# Altium schematic sheet supply.SchDoc
size A3; DocumentNumber: 5; SheetNumber: 5; SheetTotal: 6; PageSetup: Record=PageOptions|CenterHorizontal=True|CenterVertical=True|PrintScale=0.97|XCorrection=1.00|YCorrection=1.00|PrintKind=1|BorderSize=5000000|LeftOffset=0|BottomOffset=0|Orientation=2|PaperLength=2970|PaperWidth=2100|Scale=100|PaperSource=7|PrintQuality=600|MediaType=1|DitherType=10|PaperKind=A4|PrintScaleMode=1
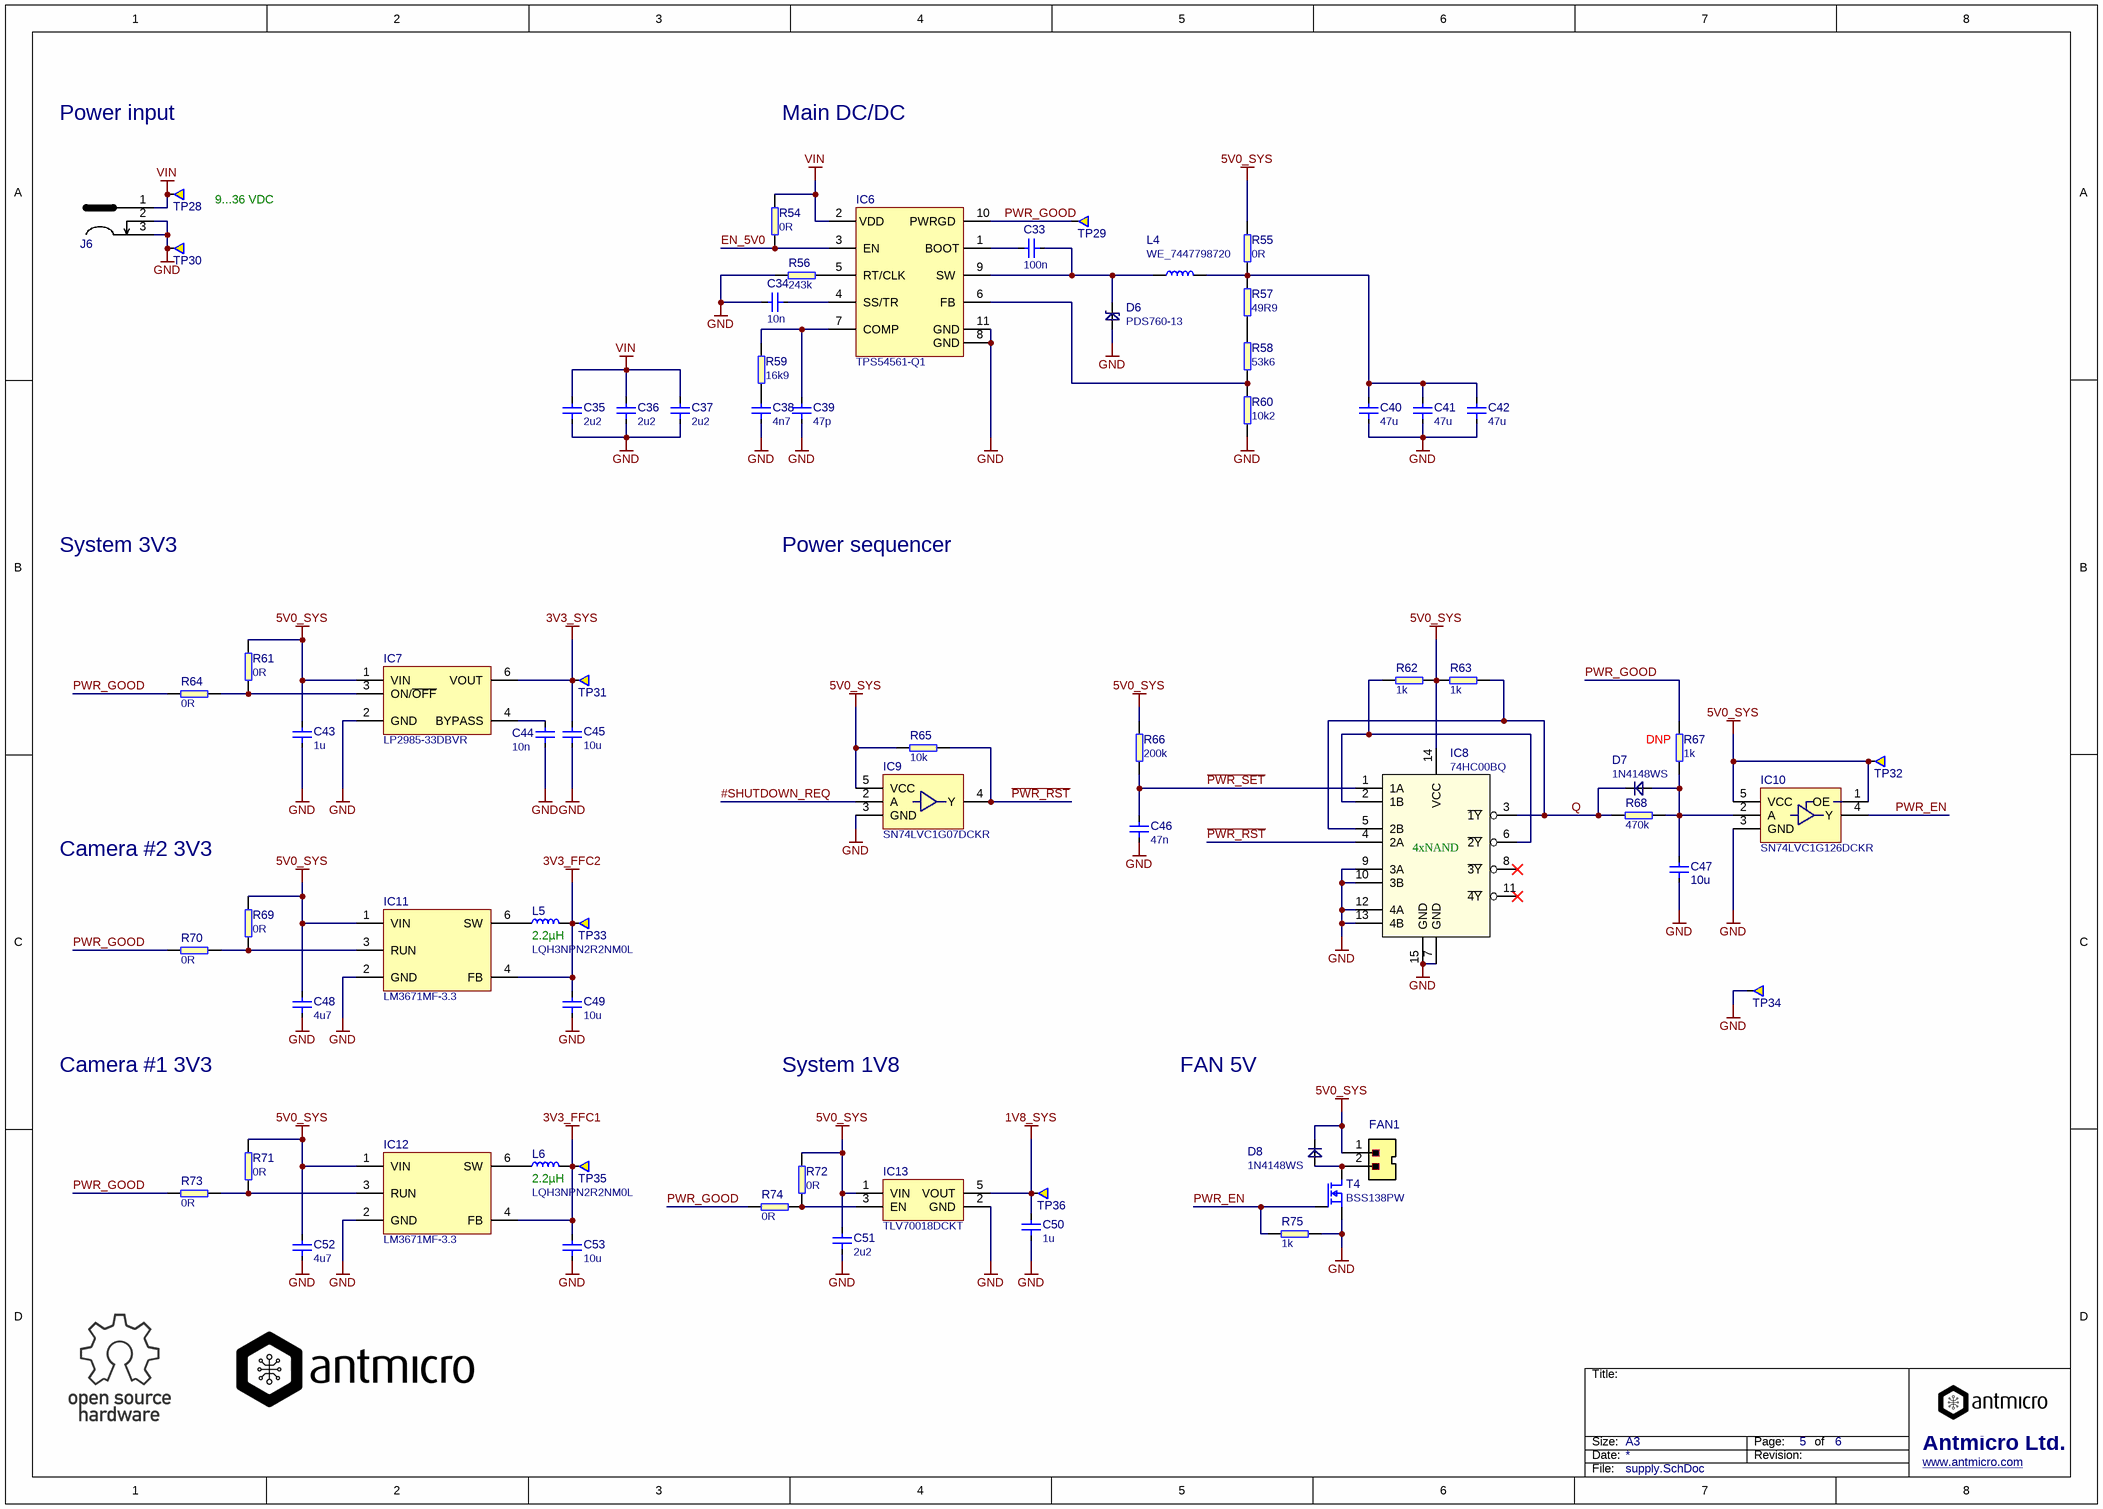
[diagram p0: supply.SchDoc]

## Parts
C33  100n  [0603]
C34  10n  [0402]
C35  2u2  [1206]
C36  2u2  [1206]
C37  2u2  [1206]
C38  4n7  [0402]
C39  47p  [0402]
C40  47u  [0805]
C41  47u  [0805]
C42  47u  [0805]
C43  1u  [0603]
C44  10n  [0402]
C45  10u  [0402]
C46  47n  [0402]
C47  10u  [0402]
C48  4u7  [0603]
C49  10u  [0603]
C50  1u  [0402]
C51  2u2  [0402]
C52  4u7  [0603]
C53  10u  [0603]
D6  PDS760-13  [PowerDI]
D7  1N4148WS  [SOD-323]
D8  1N4148WS  [SOD-323]
FAN1  MX-22-23-2021  [molex_2223-2021]  (value not drawn)
IC6  TPS54561-Q1  [WSON-10_4x4]
IC7  LP2985-33DBVR  [SOT23-5N]
IC8  74HC00BQ  [DHVQFN14]
IC9  SN74LVC1G07DCKR  [R-PDSO-G5]
IC10  SN74LVC1G126DCKR  [R-PDSO-G5]
IC11  LM3671MF-3.3  [SOT23-5N]
IC12  LM3671MF-3.3  [SOT23-5N]
IC13  TLV70018DCKT  [SC70-5]
J6  MJ-179PH  [DC_SOCKET]  (value not drawn)
L4  WE_7447798720  [WE_7447798720]
L5  LQH3NPN2R2NM0L  [LQH3NPN2R2NM]
L6  LQH3NPN2R2NM0L  [LQH3NPN2R2NM]
R54  0R  [0402]
R55  0R  [1206]
R56  243k  [0402]
R57  49R9  [0402]
R58  53k6  [0402]
R59  16k9  [0402]
R60  10k2  [0402]
R61  0R  [0402]
R62  1k  [0402]
R63  1k  [0402]
R64  0R  [0402]
R65  10k  [0402]
R66  200k  [0402]
R67  1k  [0402]
R68  470k  [0603]
R69  0R  [0402]
R70  0R  [0402]
R71  0R  [0402]
R72  0R  [0402]
R73  0R  [0402]
R74  0R  [0402]
R75  1k  [0402]
T4  BSS138PW  [SC70-3]
TP28  Testpad  [TP-R-1.5]  (value not drawn)  (no BOM)
TP29  Testpad  [TP-R-1.5]  (value not drawn)  (no BOM)
TP30  Testpad  [TP-R-1.5]  (value not drawn)  (no BOM)
TP31  Testpad  [TP-R-1.5]  (value not drawn)  (no BOM)
TP32  Testpad  [TP-R-1.5]  (value not drawn)  (no BOM)
TP33  Testpad  [TP-R-1.5]  (value not drawn)  (no BOM)
TP34  Testpad  [TP-R-1.5]  (value not drawn)  (no BOM)
TP35  Testpad  [TP-R-1.5]  (value not drawn)  (no BOM)
TP36  Testpad  [TP-R-1.5]  (value not drawn)  (no BOM)

## Nets
1V8_SYS: C50.2 IC13.5(VOUT) TP36.1
3V3_FFC1: C53.2 IC12.4(FB) L6.2 TP35.1
3V3_FFC2: C49.2 IC11.4(FB) L5.2 TP33.1
3V3_SYS: C45.2 IC7.6(VOUT) TP31.1
5V0_SYS: C43.2 C48.2 C51.2 C52.2 D8.C FAN1.1 IC7.1(VIN) IC8.14(VCC) IC9.5(VCC) IC10.1(OE) IC10.5(VCC) IC11.1(VIN) IC12.1(VIN) IC13.1(VIN) R55.2 R61.2 R62.1 R63.2 R65.1 R66.2 R69.2 R71.2 R72.1 TP32.1
GND: C34.2 C35.1 C36.1 C37.1 C38.1 C39.1 C40.1 C41.1 C42.1 C43.1 C44.1 C45.1 C46.1 C47.1 C48.1 C49.1 C50.1 C51.1 C52.1 C53.1 D6.A IC6.8(GND) IC6.11(GND) IC7.2(GND) IC8.7(GND) IC8.9(3A) IC8.10(3B) IC8.12(4A) IC8.13(4B) IC8.15(GND) IC9.3(GND) IC10.3(GND) IC11.2(GND) IC12.2(GND) IC13.2(GND) J6.2 J6.3 R56.2 R60.1 R75.1 T4.2(S) TP30.1 TP34.1
VIN: C35.2 C36.2 C37.2 IC6.2(VDD) J6.1 R54.2 TP28.1
#SHUTDOWN_REQ: IC9.2(A)
~{PWR_RST}: IC8.4(2A) IC9.4(Y) R65.2
~{PWR_SET}: C46.2 IC8.1(1A) R66.1
EN_5V0: IC6.3(EN) R54.1
PWR_EN: IC10.4(Y) R75.2 T4.1(G)
PWR_GOOD: IC6.10(PWRGD) R64.2 R67.1 R70.2 R73.2 R74.2 TP29.1
Q: D7.C IC8.3(~{1Y}) IC8.5(2B) R63.1 R68.1
NetC33_1: C33.1 D6.C IC6.9(SW) L4.1
NetC33_2: C33.2 IC6.1(BOOT)
NetC34_1: C34.1 IC6.4(SS/TR)
NetC38_2: C38.2 R59.1
NetC39_2: C39.2 IC6.7(COMP) R59.2
NetC40_2: C40.2 C41.2 C42.2 L4.2 R55.1 R57.2
NetC44_2: C44.2 IC7.4(BYPASS)
NetC47_2: C47.2 D7.A IC10.2(A) R67.2 R68.2
NetD8_A: D8.A FAN1.2 T4.3(D)
NetIC6_5: IC6.5(RT/CLK) R56.1
NetIC6_6: IC6.6(FB) R58.1 R60.2
NetIC7_3: IC7.3(ON/~{OFF}) R61.1 R64.1
NetIC8_2: IC8.2(1B) IC8.6(~{2Y}) R62.2
NetIC11_3: IC11.3(RUN) R69.1 R70.1
NetIC11_6: IC11.6(SW) L5.1
NetIC12_3: IC12.3(RUN) R71.1 R73.1
NetIC12_6: IC12.6(SW) L6.1
NetIC13_3: IC13.3(EN) R72.2 R74.1
NetR57_1: R57.1 R58.2

Not connected (* = marked no-connect by the designer): IC8 8(~{3Y})* 11(~{4Y})*

## Notes on the sheet
- Power input
- Main DC/DC
- 9...36 VDC
- System 3V3
- Power sequencer
- (near R67) DNP
- Camera #2 3V3
- (near L5) 2.2µH
- Camera #1 3V3
- System 1V8
- FAN 5V
- (near L6) 2.2µH
- Title:
- Size:
- Date:
- A3
- Revision:
- Page:
- of
- Antmicro Ltd.
- File:
- www.antmicro.com
- (in symbol 74HC00BQ) 4xNAND

## Library data of the parts
C33 = C_100n_0603: MLCC SMT Capacitor 100nF 0603; Manufacturer: AVX; PartSymbol: 0603YC104KAZ2A; PartNumber: C_100n_0603; Value: 100n
C34 C44 = C_10n_0402: MLCC SMT Capacitor 10 nF 0402; Manufacturer: AVX; PartSymbol: 04025G103ZAT2A; PartNumber: C_10n_0402; Value: 10n
C35-C37 = C_2u2_1206: MLCC SMT Capacitor 2.2uF 1206; Manufacturer: KEMET; PartSymbol: C1206C225J5RACTU; PartNumber: C_2u2_1206; Value: 2u2
C38 = C_4n7_0402: MLCC SMT Capacitor 4.7 nF 0402; Manufacturer: TDK; PartSymbol: CGA2B3X7S2A472K050BB; PartNumber: C_4n7_0402; Value: 4n7
C39 = C_47p_0402: MLCC SMT Capacitor 47pF 0402; Manufacturer: KEMET; PartSymbol: C0402C470J5GACTU; PartNumber: C_47p_0402; Value: 47p
C40-C42 = C_47u_0805: MLCC SMT Capacitor 47uF 0805; Manufacturer: KEMET; PartSymbol: C0805C476M9PACTU; PartNumber: C_47u_0805; Value: 47u
C43 = C_1u_0603: MLCC SMT Capacitor 1uF 0603; Manufacturer: KEMET; PartSymbol: C0603C105M4PACTU; Value: 1u; PartNumber: C_1u_0603
C45 C47 = C_10u_0402: MLCC SMT Capacitor 10uF 0402; Manufacturer: TDK; PartSymbol: C1005X5R0J106M050BC; Value: 10u; PartNumber: C_10u_0402
C46 = C_47n_0402: MLCC SMT Capacitor 47nF 0402; Manufacturer: MULTICOMP; PartSymbol: MC0402X473K160CT; PartNumber: C_47n_0402; Value: 47n
C48 C52 = C_4u7_0603: MLCC SMT Capacitor 4.7uF 0603; Manufacturer: MULTICOMP; PartSymbol: MC0603X475K6R3CT; Value: 4u7; PartNumber: C_4u7_0603
C49 C53 = C_10u_0603: MLCC SMT Capacitor 10uF 0603; Manufacturer: Walsin; PartSymbol: 0603X106M6R3CT; Value: 10u; PartNumber: C_10u_0603
C50 = C_1u_0402: MLCC SMT Capacitor 1uF 0402; Manufacturer: MULTICOMP; PartSymbol: MC0402F105Z6R3CT; Value: 1u; PartNumber: C_1u_0402
C51 = C_2u2_0402: MLCC SMT Capacitor 2.2uF 0402; Manufacturer: TDK; PartSymbol: C1005X5R1A225K050BC; Value: 2u2; PartNumber: C_2u2_0402
D6 = Diode Schottky: DIODE SCHOTTKY 60V 7A POWERDI5; Manufacturer: DIODES INC.; PartNumber: PDS760-13; Value: PDS760-13; PartSymbol: PDS760-13
D7 D8 = diode: Diode small signal; Manufacturer: ON SEMICONDUCTOR; PartNumber: 1N4148WS; Value: 1N4148WS; PartSymbol: 1N4148WS
FAN1 = molex_2223-2021: Pinhead connector with key; Manufacturer: Molex; PartSymbol: 022232021 A-6373-02A222; Value: MX-22-23-2021; PartNumber: molex_2223-2021
IC6 = TPS54561: IC REG BCK SPLIT RAIL ADJ 10WSON; Manufacturer: Texas Instruments; PartNumber: TPS54561-Q1; Value: TPS54561-Q1; PartSymbol: TPS54561-Q1
IC7 = LP2992AIM5-3.3: Fixed LDO Voltage Regulator, 2.2V to 16V, 280mV Dropout, 3.3Vout, 150mAout, SOT-23-5; Manufacturer: Texas Instruments; Value: LP2985-33DBVR; PartNumber: LP2985-33DBVR; PartSymbol: LP2985-33DBVR
IC8 = 74HC00BQ: 2 NAND Gate, 4 channel; Manufacturer: NEXPERIA; PartNumber: 74HC00BQ; Value: 74HC00BQ; PartSymbol: 74HC00BQ
IC9 = SN74LVC1G07: Buffer, open drain; Manufacturer: Texas Instruments; PartSymbol: SN74LVC1G07GW; PartNumber: SN74LVC1G07DCKR; Value: SN74LVC1G07DCKR
IC10 = SN74LVC1G126: Buffer, tri-state; Manufacturer: Texas Instruments; PartNumber: SN74LVC1G126DCKR; Value: SN74LVC1G126DCKR; PartSymbol: SN74LVC1G126DCKR
IC11 IC12 = LM3671: DC/DC Buck Converter; Manufacturer: Texas Instruments; PartSymbol: LM3671MF-3.3/NOPB; Value: LM3671MF-3.3; PartNumber: LM3671MF-3.3
IC13 = TLV700: Voltage Regulator, 2V to 5.5V, 175mV Dropout, 1.8Vout, 200mAout; Manufacturer: Texas Instruments; Value: TLV70018DCKT; PartNumber: TLV70018DCKT; PartSymbol: TLV70018DCKT
J6 = DC_SOCKET: DC Power Connector, Jack, 4 A, 1.95 mm, PCB Mount, Through Hole; Manufacturer: MULTICOMP; PartNumber: DC_SOCKET; PartSymbol: MJ-179PH; Value: MJ-179PH
L4 = WE_7447798720: Fixed Inductors WE-PDF 1064 7.2uH 7.9A 12.8mOhm; Manufacturer: WURTH ELEKTRONIK; PartNumber: WE_7447798720; Value: WE_7447798720; RatedCurrent: 7.9A; Inductance: 7.2uH; PartSymbol: 7447798720
L5 L6 = LQH3NPN2R2NM0L: INDUCTOR, 2.2 ?H, ? 30%, 1212, 90 MHz, 0.073 ohm; Manufacturer: MURATA; Inductance: 2.2uH; Value: LQH3NPN2R2NM0L; PartNumber: LQH3NPN2R2NM0L; PartSymbol: LQH3NPN2R2NM0L
R54 R61 R64 R69-R74 = R_0R_0402: RES, 0R, 0402; Manufacturer: Panasonic; PartSymbol: ERJ2GE0R00X; PartNumber: R_0R_0402; Value: 0R
R55 = R_0R_1206: RES, 0R, 1206; Manufacturer: MULTICOMP; PartSymbol: MCMR12X000 PTL; PartNumber: R_0R_1206; Value: 0R
R56 = R_243k_0402: RES, 243k, 0402; Manufacturer: MULTICOMP; PartSymbol: MCMR04X2433FTL; PartNumber: R_243k_0402; Value: 243k
R57 = R_49R9_0402: RES, 49R9, 0402; Manufacturer: VISHAY; PartSymbol: CRCW040249R9FKED; PartNumber: R_49R9_0402; Value: 49R9
R58 = R_53k6_0402: RES, 53k6, 0402; Manufacturer: TE Connectivity; PartSymbol: CPF0402B53K6E1; PartNumber: R_53k6_0402; Value: 53k6
R59 = R_16k9_0402: RES, 16k9, 0402; Manufacturer: Panasonic; PartSymbol: ERA2AEB1692X; PartNumber: R_16k9_0402; Value: 16k9
R60 = R_10k2_0402: RES, 10k2, 0402, 0.1%; PartNumber: R_10k2_0402_0.1%; Manufacturer: TE Connectivity; PartSymbol: CPF0402B10K2E1; Value: 10k2; Tolerance: 0.1%
R62 R63 R67 R75 = R_1k_0402: RES, 1k, 0402; Manufacturer: BOURNS; PartSymbol: CR0402-FX-1001GLF; PartNumber: R_1k_0402; Value: 1k
R65 = R_10k_0402: RES, 10k, 0402; Manufacturer: MULTICOMP; PartSymbol: MCMR04X1002FTL; PartNumber: R_10k_0402; Value: 10k
R66 = R_200k_0402: RES, 200k, 0402; Manufacturer: YAGEO; PartSymbol: RC0402FR-07200KL; PartNumber: R_200k_0402; Value: 200k
R68 = R_470k_0603: RES, 470k, 0603; Manufacturer: VISHAY; PartSymbol: CRCW0603470KFKEA; PartNumber: R_470k_0603; Value: 470k
T4 = NMOS: MOSFET, N CH, 60V, 0.2A; Manufacturer: NXP; Value: BSS138PW; PartNumber: BSS138PW; PartSymbol: BSS138PW
TP28-TP36 = Testpad: Testpad, round, 1.5mm; PartNumber: TP-R-1.5